# EAGLE design 85 SOP8 v3 (EAGLE 9.3.1)
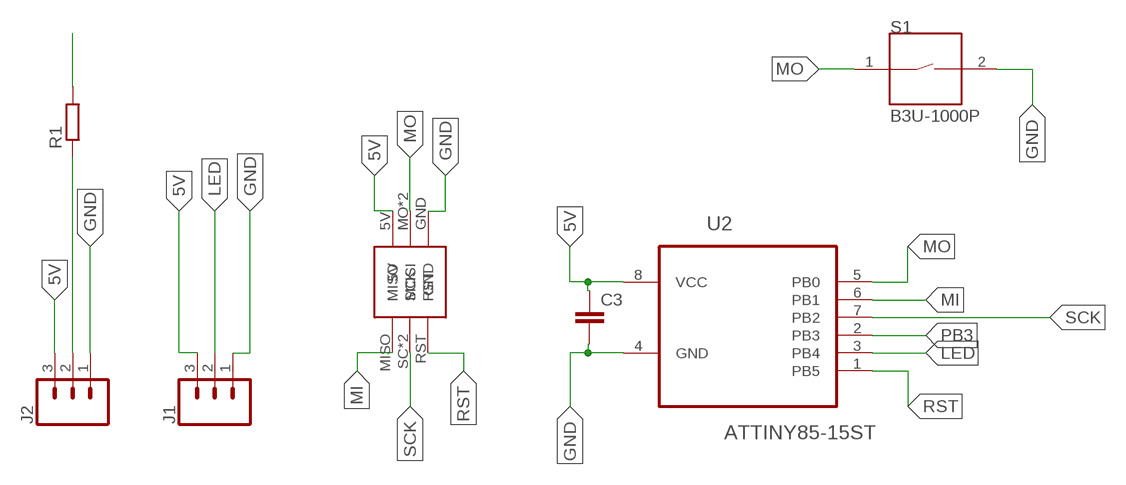
[diagram p0: schematic, sheet 1]

## Parts
C3  C-EUC0603  [C0603]
J1  CONN_031X03_NO_SILK  [1X03_NO_SILK]
J2  CONN_031X03_NO_SILK  [1X03_NO_SILK]
R1  R-EU_R0603  [R0603]
S1  B3U-1000P  [SW_B3U-1000P]
U2  ATTINY85-15ST  [SOIC127P798X216-8N]
U$1  ISCP_PORTPOGONEW  [ISCP_PADS_2ROW2HNEW]

## Nets
5V: C3.1 J1.3 J2.3 U2.8(VCC) U$1.5V
GND: C3.2 J1.1 J2.1 S1.2 U2.4(GND) U$1.GND
LED: J1.2 U2.3(PB4)
MI: U2.6(PB1) U$1.MISO
MO: S1.1 U2.5(PB0) U$1.MO(MOSI) U$1.MOSI
N$1: J2.2 R1.1
PB3: U2.2(PB3)
RST: U2.1(PB5) U$1.RST
SCK: R1.2 U2.7(PB2) U$1.SC(SCK) U$1.SCK

## Library data of the parts
C3 = resistor:C-EU: CAPACITOR, European symbol
J1 J2 = SparkFun-Connectors:CONN_03: Multi connection point. Often used as Generic Header-pin footprint for 0.1 inch spaced/style header connections On any of the 0.1 inch spaced packages, you can populate with these: Break Away Headers - Straight <https://www.sparkfun.com/products/116> (PRT-00116) Break Away Male Headers - Right Angle <https://www.sparkfun.com/products/553> (PRT-00553) Female Headers <https://www.sparkfun.com/products/115> (PRT-00115) Break Away Headers - Machine Pin <https://www.sparkfun.com/products/117> (PRT-00117) Break Away Female Headers - Swiss Machine Pin <https://www.sparkfun.com/products/743> (PRT-00743) Stackable Header - 3 Pin (Female, 0.1") <https://www.sparkfun.com/products/13875> (PRT-13875) For SCREWTERMINALS and SPRING TERMINALS visit here: Screw Terimnals on SparkFun.com <https://www.sparkfun.com/search/results?term=Screw+Terminals> (5mm/3.5mm/2.54mm spacing) This device is also useful as a general connection point to wire up your design to another part of your project. Our various solder wires solder well into these plated through hole pads. Hook-Up Wire - Assortment (Stranded, 22 AWG) <https://www.sparkfun.com/products/11375> (PRT-11375) Hook-Up Wire - Assortment (Solid Core, 22 AWG) <https://www.sparkfun.com/products/11367> (PRT-11367) View the entire wire category on our website here <https://www.sparkfun.com/categories/141> Special notes: Molex polarized connector foot print use with SKU : PRT-08232 with associated crimp pins and housings.
R1 = resistor:R-EU_: RESISTOR, European symbol
S1 = B3U-1000P:B3U-1000P: Switch Tactile N.O. SPST Round Button Gull Wing 0.05A 12VDC 1.5N SMD Embossed T/R; AVAILABILITY: Unavailable; DESCRIPTION: Switch Tactile N.O. SPST Round Button Gull Wing 0.05A 12VDC 1.5N SMD Embossed T/R; MF: Omron; MP: B3U-1000P; PACKAGE: None; PRICE: None
U2 = ATTINY85-15ST:ATTINY85-15ST: 8-bit Microcontroller with In-System Programmable Flash; AVAILABILITY: Unavailable; DESCRIPTION: MCU 8-bit ATtiny AVR RISC 8KB Flash 3.3V/5V 8-Pin SOIC; MF: Microchip; MP: ATTINY85-15ST; PACKAGE: SOIC-8 Microchip; PRICE: None
U$1 = CoreDuino:ISCP_PORT

## Board
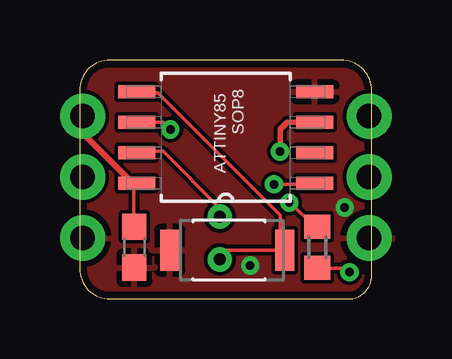
[diagram p1: board, top side]
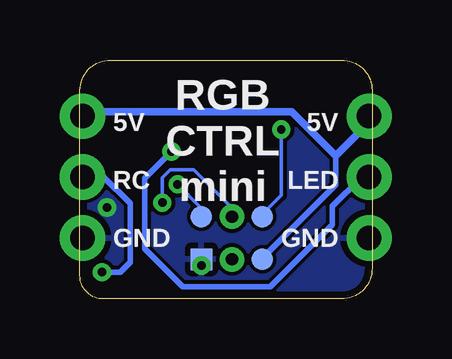
[diagram p2: board, bottom side, seen from below]

Size 12.17 x 9.96 mm. Coordinates in mm from the lower left corner, seen from the top.
Outline: 12.17,0.97 12.17,8.69 arc90 10.9,9.96 1.27,9.96 arc90 0,8.69 0,1.27 arc90 1.27,0 11.21,0 arc90 12.17,0.97
Copper layers (1*16): Top 0.035mm / dielectric 1.5mm / Bottom 0.035mm
Design rules "default *": minimum track width 6mil, minimum drill 0.35mm, track to track 6mil, track to pad 6mil, pad to pad 6mil, via to via 6mil, smd to smd 6mil, copper to edge 0.3mm, drill to drill 6mil, minimum pad ring 10mil, minimum via ring 8mil, stop-mask expansion 4mil, vias tented up to drill 1mm, thermal gap 10mil

### Footprints (pad centres in the part's own frame; a part is rotated, then mirrored left to right if it is on the bottom)
C0603 = smd 1.1 x 1: 1 -0.85,0; 2 0.85,0
1X03_NO_SILK = drill 1.016 pad 1.88: 1 0,0; 2 2.54,0; 3 5.08,0
R0603 = smd 1 x 1.1: 1 -0.85,0; 2 0.85,0
SW_B3U-1000P = smd 0.8 x 1.7: 1 -2.335,0; 2 2.462,0
SOIC127P798X216-8N = smd 1.549 x 0.533: 1 -3.708,1.905; 2 -3.708,0.635; 3 -3.708,-0.635; 4 -3.708,-1.905; 5 3.708,-1.905; 6 3.708,-0.635; 7 3.708,0.635; 8 3.708,1.905
ISCP_PADS_2ROW2HNEW = smd 0.889 x 0.889: 5V -1.27,1.778; GND 1.27,1.778; MISO -1.27,0; MOSI 0,1.778; RST 1.27,0; SCK 0,0 | drill 0.508 pad 0.889: MO 0,1.778; SC 0,0

### Placement (x,y rotation side)
C3  2.29,2.16 270 top
J1  0.13,2.54 90 top
J2  12.07,2.54 90 top
R1  9.91,2.16 90 top
S1  6.22,2.03 180 top
U2  6.1,6.73 180 top
U$1  5.84,3.43 180 bottom

### Tracks (layer width: path | path; a pad name or v marks a point on that pad's centre or on a via)
5V
  Top 0.152: C3.1 2.26,3.1 2.26,4.77 U2.8 2.26,4.93 2.11,4.93 | J1.3 0.13,6.91
  Top 0.229: 0.13,6.91 2.11,4.93
  Bottom 0.152: J1.3 0.13,7.37 | 4.55,1.73 U$1.5V | J2.3 11.89,7.8
  Bottom 0.229: 4.55,1.73 1.52,4.75 1.52,5.97
  Bottom 0.305: 0.13,7.37 1.52,5.97 3.35,7.8 11.89,7.8
GND  (via drill 0.35)
  other vias: 7.11,1.4 11.05,3.81
  pour Top: 0,10.67 13.08,10.67 13.08,-0.76 0,-0.76
  pour Bottom: 0.13,10.67 0.13,-0.76 12.83,-0.76 12.83,10.67
LED  (via drill 0.35)
  Top 0.229: U2.3 8.66,7.37 8.36,7.06 v8.36,6.15
  Bottom 0.152: J1.2 0.43,5.08
  Bottom 0.229: v8.36,6.15 9.47,5.03 9.47,2.08 7.9,0.51 4.24,0.51 1.65,3.1 1.65,3.86 0.43,5.08
MI  (via drill 0.35)
  Top 0.152: v3.79,7.06 3.48,7.37 U2.6
  Bottom 0.152: v3.79,7.06 3.79,4.32 4.55,3.56 U$1.MISO
MO
  Top 0.152: U2.5 2.41,8.58 3.25,8.58 8.36,3.48 8.36,2.74 8.66,2.44 8.66,2.03 S1.1 6.15,2.03 5.84,1.73 5.92,1.73 U$1.MO
  Bottom 0.152: 5.92,1.73 U$1.MO
N$1  (via drill 0.35)
  Top 0.152: v11.25,1.12 11.1,1.27 10.03,1.27 R1.1
  Bottom 0.229: v11.25,1.12 10.49,1.12 10.08,1.52 10.08,3.99 11.18,5.08 J2.2
RST  (via drill 0.35)
  Top 0.152: v8.1,4.77 9.73,4.77 U2.1
  Bottom 0.152: v8.1,4.77 7.2,3.87 U$1.RST
SCK  (via drill 0.35)
  Top 0.152: R1.2 9.79,3.01 8.79,4.01 v8.74,4.01 | U$1.SCK 5.89,3.48 5.89,3.73 3.48,6.15 2.41,6.15 U2.7
  Bottom 0.152: 5.92,3.4 U$1.SCK 5.92,3.56 5.92,3.86 7.44,5.38 8.41,5.38 8.74,5.05 v8.74,4.01

### Text on the board
tNames: ATTINY85 / SOP8
bNames: 5V | 5V | RGB / CTRL / mini | LED | RC | GND | GND